# Altium schematic sheet CPU.SchDoc
size A4
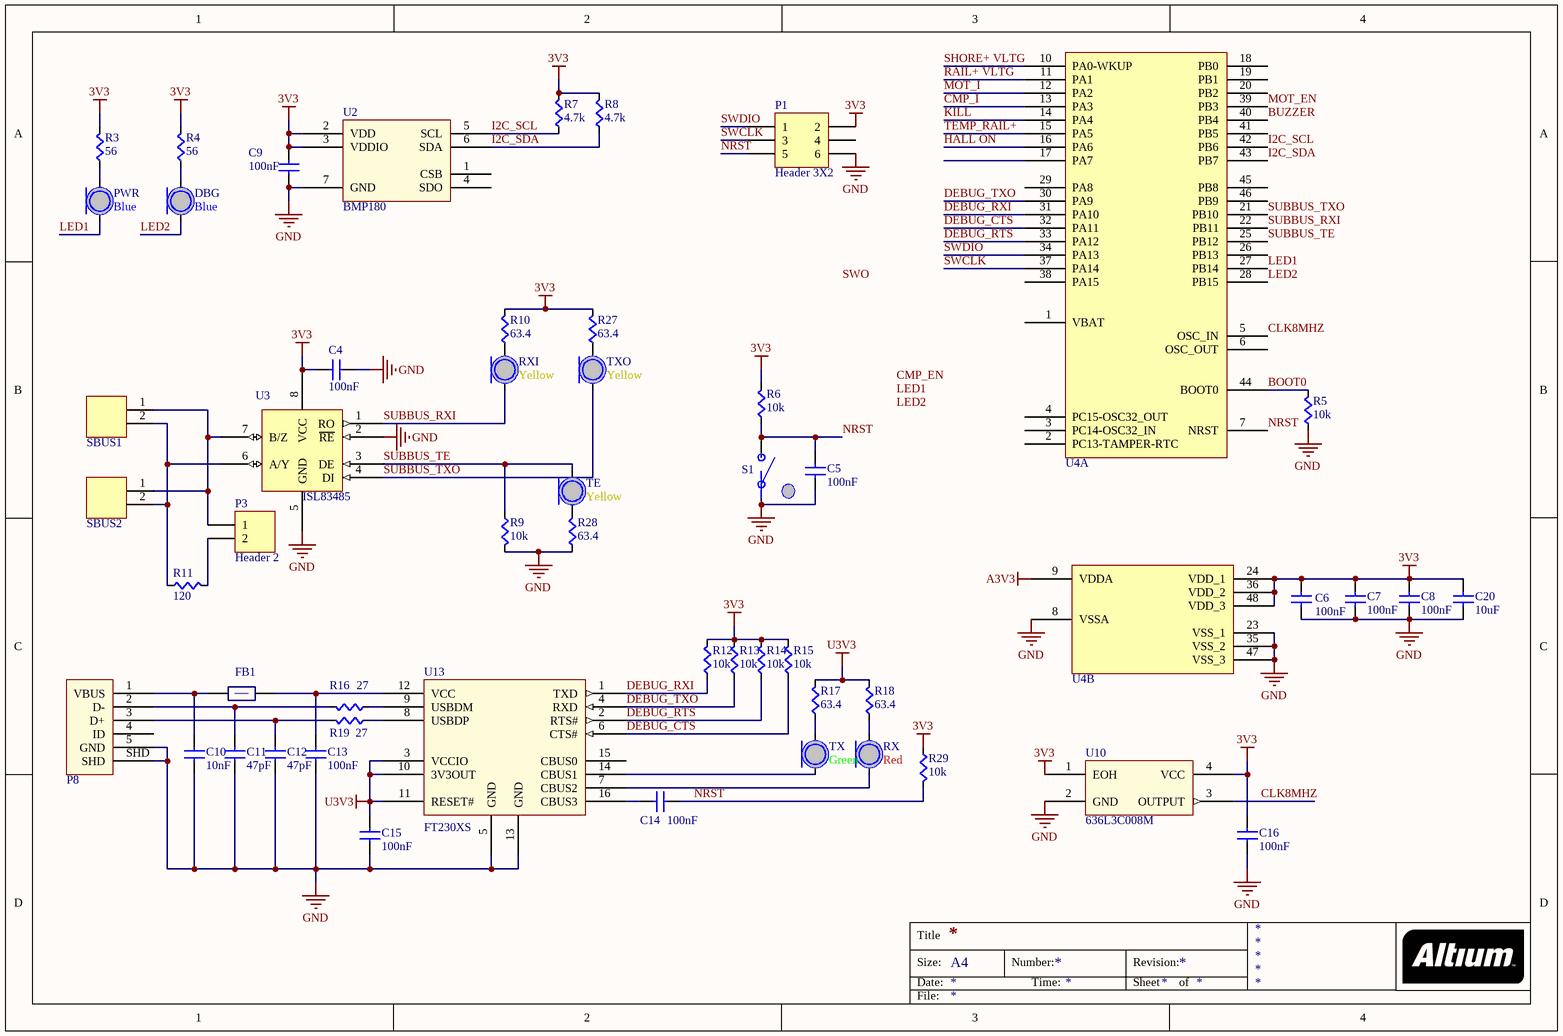
[diagram p0: CPU.SchDoc]

## Parts
C4  value 100nF  [CAPC0603]  (hidden comment: Cap)
C5  value 100nF  [CAPC0603]  (hidden comment: Cap)
C6  value 100nF  [CAPC0603]  (hidden comment: Cap)
C7  value 100nF  [CAPC0603]  (hidden comment: Cap)
C8  value 100nF  [CAPC0603]  (hidden comment: Cap)
C9  value 100nF  [CAPC0603]  (hidden comment: Cap)
C10  value 10nF  [CAPC0603]  (hidden comment: Cap)
C11  value 47pF  [CAPC0603]  (hidden comment: Cap)
C12  value 47pF  [CAPC0603]  (hidden comment: Cap)
C13  value 100nF  [CAPC0603]  (hidden comment: Cap)
C14  value 100nF  [CAPC0603]  (hidden comment: Cap)
C15  value 100nF  [CAPC0603]  (hidden comment: Cap)
C16  value 100nF  [CAPC0603]  (hidden comment: Cap)
C20  value 10uF  [CAPC1206]  (hidden comment: Cap)
DBG  Color: Blue  [LED0805]  (hidden comment: LED)
FB1  FBead  [RES0603]  (value not drawn)
P1  Header 3X2  [HDR2X3]
P3  Header 2  [HDR1X2]
P8  UX60SC-MB-5ST  [UX60SC-MB-5ST]  (value not drawn)
PWR  Color: Blue  [LED0805]  (hidden comment: LED)
R3  value 56  [RES0603]  (hidden comment: Res)
R4  value 56  [RES0603]  (hidden comment: Res)
R5  value 10k  [RES0603]  (hidden comment: Res)
R6  value 10k  [RES0603]  (hidden comment: Res)
R7  value 4.7k  [RES0603]  (hidden comment: Res)
R8  value 4.7k  [RES0603]  (hidden comment: Res)
R9  value 10k  [RES0603]  (hidden comment: Res)
R10  value 63.4  [RES0603]  (hidden comment: Res)
R11  value 120  [RES0603]  (hidden comment: Res)
R12  value 10k  [RES0603]  (hidden comment: Res)
R13  value 10k  [RES0603]  (hidden comment: Res)
R14  value 10k  [RES0603]  (hidden comment: Res)
R15  value 10k  [RES0603]  (hidden comment: Res)
R16  value 27  [RES0603]  (hidden comment: Res)
R17  value 63.4  [RES0603]  (hidden comment: Res)
R18  value 63.4  [RES0603]  (hidden comment: Res)
R19  value 27  [RES0603]  (hidden comment: Res)
R27  value 63.4  [RES0603]  (hidden comment: Res)
R28  value 63.4  [RES0603]  (hidden comment: Res)
R29  value 10k  [RES0603]  (hidden comment: Res)
RX  Color: Red  [LED0805]  (hidden comment: LED)
RXI  Color: Yellow  [LED0805]  (hidden comment: LED)
S1  Button  [PTS645xxxxSMTR92]  (value not drawn)
SBUS1  2-pin Horz Sherlock  [MOLEX-HDR-1X2-SHERLOCK-HORZ]  (value not drawn)
SBUS2  2-pin Horz Sherlock  [MOLEX-HDR-1X2-SHERLOCK-HORZ]  (value not drawn)
TE  Color: Yellow  [LED0805]  (hidden comment: LED)
TX  Color: Green  [LED0805]  (hidden comment: LED)
TXO  Color: Yellow  [LED0805]  (hidden comment: LED)
U2  BMP180  [BMP180]
U3  ISL83485  [ISL8348xIBZ]
U4  STM32F103C8T7  [STM32F103C8T7]  (value not drawn)  (parts A,B of 2)
U10  636L3C008M  [636L3C]
U13  FT230XS  [FT230XS]

## Nets
3V3: C4.2(B) C6.1(A) C7.1(A) C8.1(A) C9.1(A) C16.1(A) C20.2(B) P1.2 R3.1(A) R4.1(A) R6.1(A) R7.1(A) R8.1(A) R10.1(A) R12.1(A) R13.1(A) R14.1(A) R15.1(A) R27.1(A) R29.1(A) U2.2(VDD) U2.3(VDDIO) U3.8(VCC) U4.24(VDD_1) U4.36(VDD_2) U4.48(VDD_3) U10.1(EOH) U10.4(VCC)
A3V3: U4.9(VDDA)
GND: C4.1(A) C5.2(B) C6.2(B) C7.2(B) C8.2(B) C9.2(B) C10.2(B) C11.2(B) C12.2(B) C13.2(B) C15.2(B) C16.2(B) C20.1(A) P1.6 P8.5(GND) P8.SHD R5.2(B) R9.2(B) R28.2(B) S1.A U2.7(GND) U3.2(~{RE}) U3.5(GND) U4.8(VSSA) U4.23(VSS_1) U4.35(VSS_2) U4.47(VSS_3) U10.2(GND) U13.5(GND) U13.13(GND)
U3V3: C15.1(A) R17.1(A) R18.1(A) U13.3(VCCIO) U13.10(3V3OUT) U13.11(RESET#)
BOOT0: R5.1(A) U4.44(BOOT0)
BUZZER: U4.40(PB4)
CLK8MHZ: U4.5(OSC_IN) U10.3(OUTPUT)
CMP_I: U4.13(PA3)
DEBUG_CTS: R15.2(B) U4.32(PA11) U13.6(CTS#)
DEBUG_RTS: R14.2(B) U4.33(PA12) U13.2(RTS#)
DEBUG_RXI: R12.2(B) U4.31(PA10) U13.1(TXD)
DEBUG_TXO: R13.2(B) U4.30(PA9) U13.4(RXD)
HALL ON: U4.16(PA6)
I2C_SCL: R7.2(B) U2.5(SCL) U4.42(PB6)
I2C_SDA: R8.2(B) U2.6(SDA) U4.43(PB7)
KILL: U4.14(PA4)
LED1: PWR.C U4.27(PB14)
LED2: DBG.C U4.28(PB15)
MOT_EN: U4.39(PB3)
MOT_I: U4.12(PA2)
NRST: C5.1(A) C14.2(B) P1.5 R6.2(B) R29.2(B) S1.B U4.7(NRST)
RAIL+ VLTG: U4.11(PA1)
SHORE+ VLTG: U4.10(PA0-WKUP)
SUBBUS_RXI: RXI.C U3.1(RO) U4.22(PB11)
SUBBUS_TE: R9.1(A) TE.A U3.3(DE) U4.25(PB12)
SUBBUS_TXO: TXO.C U3.4(DI) U4.21(PB10)
SWCLK: P1.3 U4.37(PA14)
SWDIO: P1.1 U4.34(PA13)
TEMP_RAIL+: U4.15(PA5)
NetC10_1: C10.1(A) FB1.2(B) P8.1(VBUS)
NetC11_1: C11.1(A) P8.2(D-) R16.1(A)
NetC12_1: C12.1(A) P8.3(D+) R19.1(A)
NetC13_1: C13.1(A) FB1.1(A) U13.12(VCC)
NetC14_1: C14.1(A) U13.16(CBUS3)
NetDBG_A: DBG.A R4.2(B)
NetP3_1: P3.1 SBUS1.1 SBUS2.1 U3.7(B/Z)
NetP3_2: P3.2 R11.1(A)
NetPWR_A: PWR.A R3.2(B)
NetR10_2: R10.2(B) RXI.A
NetR11_2: R11.2(B) SBUS1.2 SBUS2.2 U3.6(A/Y)
NetR16_2: R16.2(B) U13.9(USBDM)
NetR17_2: R17.2(B) TX.A
NetR18_2: R18.2(B) RX.A
NetR19_2: R19.2(B) U13.8(USBDP)
NetR27_2: R27.2(B) TXO.A
NetR28_1: R28.1(A) TE.C
NetRX_C: RX.C U13.7(CBUS2)
NetTX_C: TX.C U13.14(CBUS1)

Not connected (* = marked no-connect by the designer): P1 4; P8 4(ID); U2 1(CSB) 4(SDO); U4 1(VBAT) 2(PC13-TAMPER-RTC) 3(PC14-OSC32_IN) 4(PC15-OSC32_OUT) 6(OSC_OUT) 17(PA7) 18(PB0) 19(PB1) 20(PB2) 26(PB13) 29(PA8) 38(PA15) 41(PB5) 45(PB8) 46(PB9); U13 15(CBUS0)

## Notes on the sheet
- Labels drawn without touching a wire or pin: CMP_EN, LED1, LED2, SWO
- Title
- Size:
- Date:
- A4
- Number:
- Time:
- Revision:
- Sheet
- of
- File:

## Library data of the parts
FB1 = FBead: Ferrite Bead; Supplier 1: Digi-Key; Supplier Part Number 1: 445-2988-1-ND
P1 = Header 3X2: Header, 3-Pin, Dual row; LatestRevisionDate: 17-Jul-2002; LatestRevisionNote: Re-released for DXP Platform.; Publisher: Altium Limited
P3 = Header 2: Header, 2-Pin; LatestRevisionDate: 17-Jul-2002; LatestRevisionNote: Re-released for DXP Platform.; Publisher: Altium Limited
P8 = UX60SC-MB-5ST: USB Mini B Metal Shield SMT; Supplier 1: Digi-Key; Supplier Part Number 1: H11671CT-ND
S1 = Button: SPST Button; Supplier 1: Digi-Key; Supplier Part Number 1: CKN9087CT-ND
SBUS1 SBUS2 = MOLEX-HDR-1x2-SHERLOCK_RA: Header, Molex, 2mm Pitch Sherlock Header, Single Row, Horizontal, 2 Circuits, Length 3.3mm,  0353630260; Manufacturer: Molex Inc; Manufacturer Part Number: 0353630260; Supplier Part Number: WM18931-ND; Supplier: Digi-Key
U2 = BMP180: Digital Pressure Sensor; Supplier 1: Digi-Key; Supplier Part Number 1: 828-1027-1-ND
U3 = ISL83485: 3.3V RS485 Transceiver; Supplier 1: Digi-Key; Supplier Part Number 1: ISL83485IBZ-ND
U4 = STM32F103C8T7: MCU ARM 32BIT 64K FLASH 48-LQFP; Supplier 1: Digi-Key; Supplier Part Number 1: 497-11517-ND
U10 = 636L3C: HCMOS/TTL Clock Oscillator; Supplier 1: Digi-Key; Supplier Part Number 1: CTX1005CT-ND
U13 = FT230XS: USB To Basic UART IC; Supplier 1: Digi-Key; Supplier Part Number 1: 768-1154-5-ND
C4-C16 C20 = Cap: Supplier 1: Digi-Key
  C4-C9 C13-C16: Supplier Part Number 1: 1276-1000-1-ND
  C10: Supplier Part Number 1: 445-1311-1-ND
  C11 C12: Supplier Part Number 1: 445-1277-1-ND
  C20: Supplier Part Number 1: 1276-2876-1-ND
DBG PWR RX RXI TE TX TXO = LED: Supplier 1: Digi-Key
  DBG PWR: Supplier Part Number 1: 350-2046-1-ND
  RX: Supplier Part Number 1: 754-1133-1-ND
  RXI TE TXO: Supplier Part Number 1: 475-2560-1-ND
  TX: Supplier Part Number 1: 160-1887-1-ND
R3-R19 R27-R29 = Res: Supplier 1: Digi-Key
  R3 R4: Supplier Part Number 1: RMCF0603JT56R0CT-ND
  R5 R6 R9 R12-R15 R29: Supplier Part Number 1: RMCF0603JT10K0CT-ND
  R7 R8: Supplier Part Number 1: RMCF0603JT4K70CT-ND
  R10 R17 R18 R27 R28: Supplier Part Number 1: RMCF0603FT63R4CT-ND
  R11: Supplier Part Number 1: RHM120HCT-ND
  R16 R19: Supplier Part Number 1: RMCF0603JT27R0CT-ND